# Altium schematic sheet 201_ConnectionPart2-Part1.SchDoc: Connector to Part 1
size A2; Organization: Greenfield Tech Solutions; Address1: Molendreef 33; Address2: Ossendrecht; Address3: 4641CS; Address4: The Netherlands; SheetNumber: 3; SheetTotal: 9
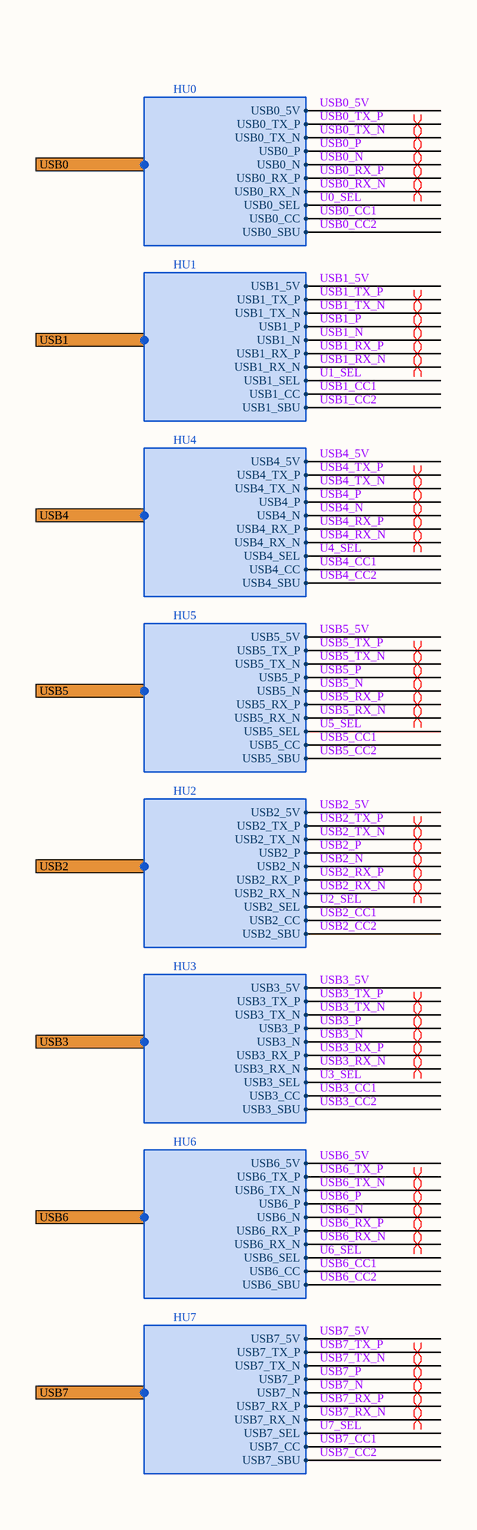
[diagram p0: 201_ConnectionPart2-Part1.SchDoc, left]
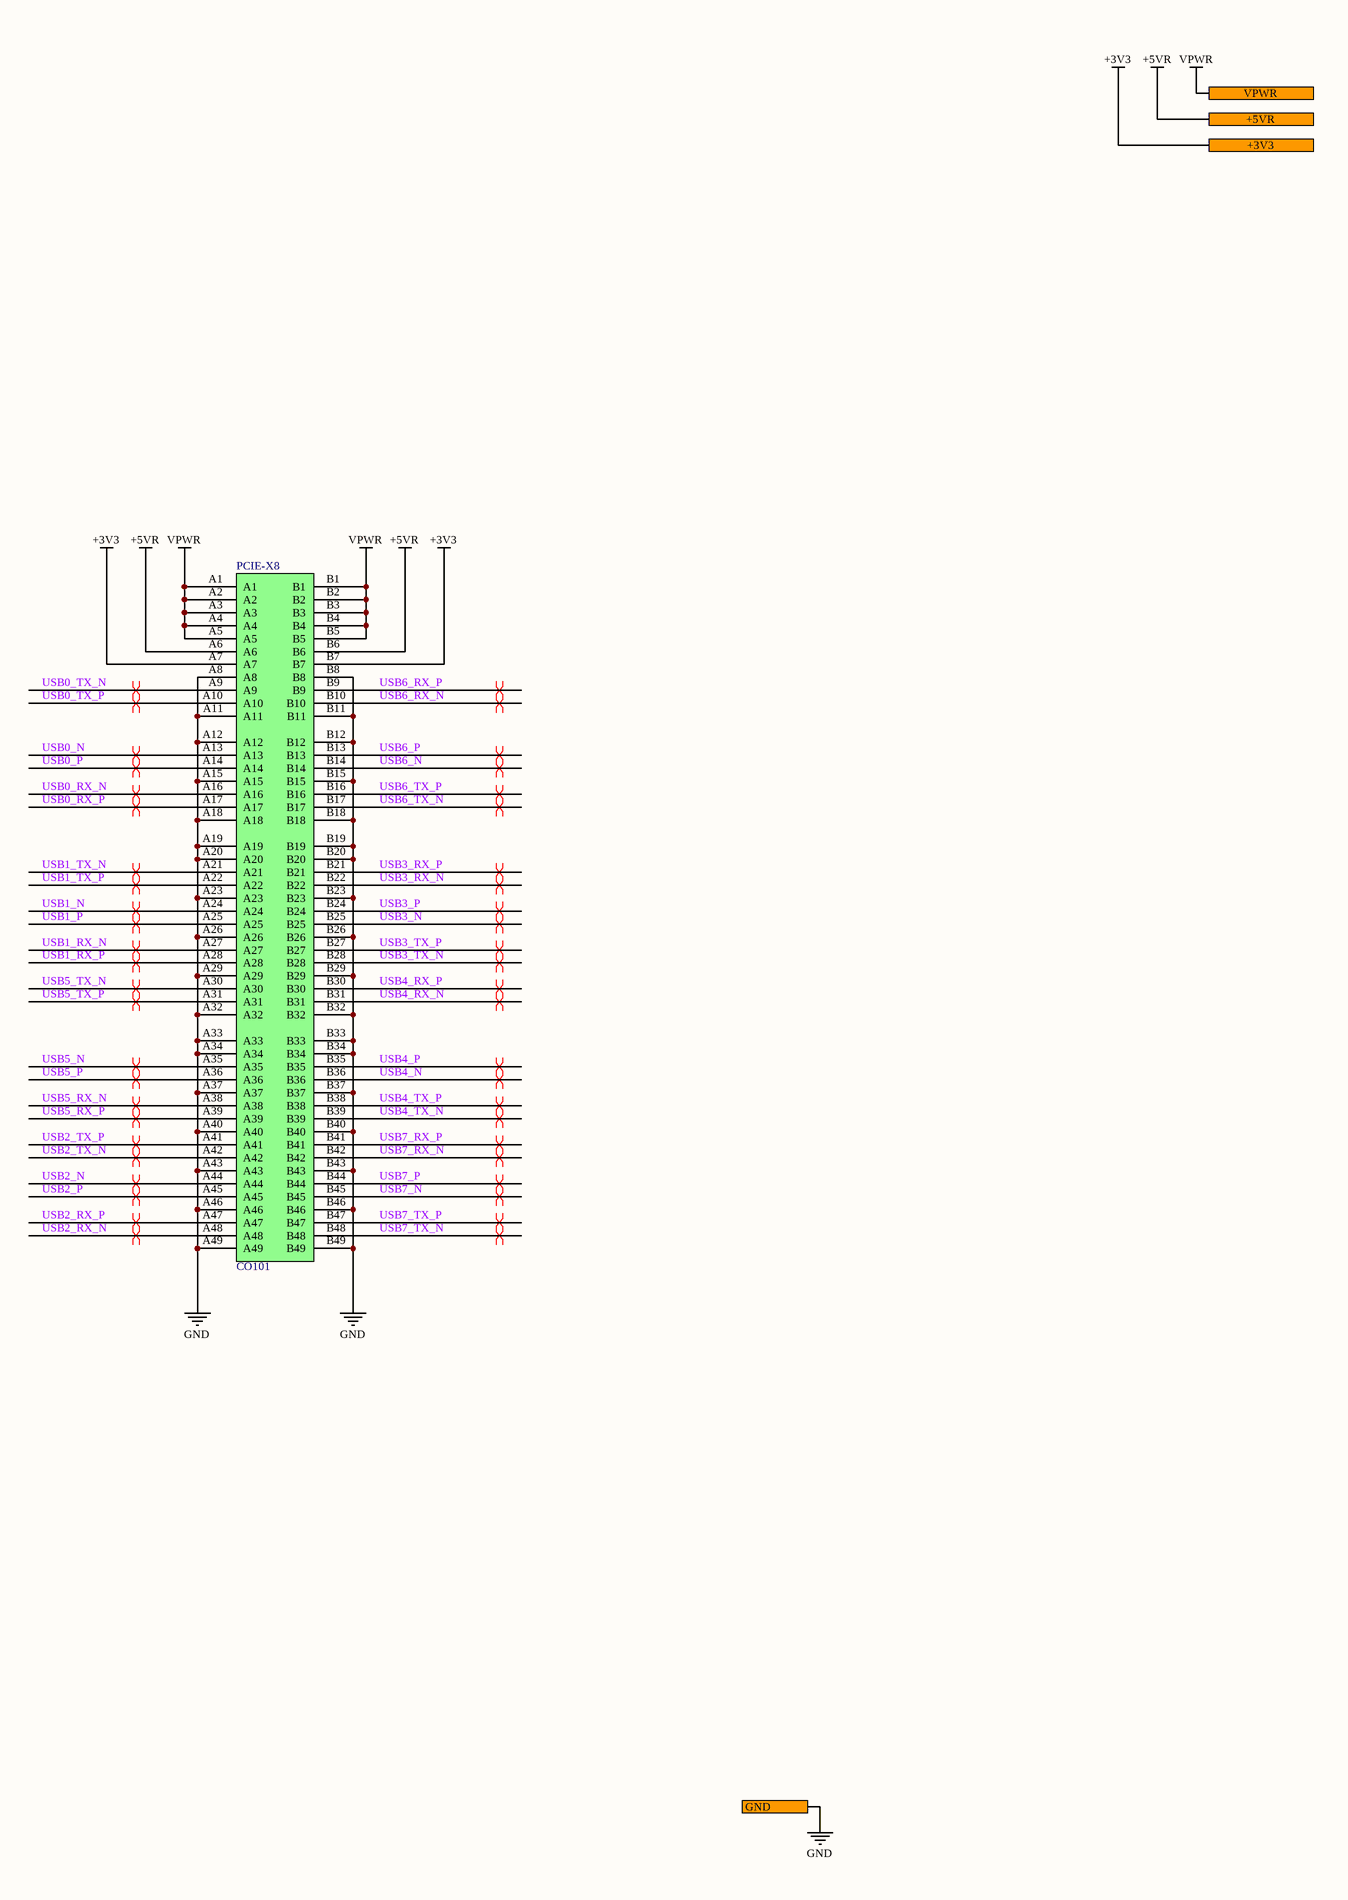
[diagram p1: 201_ConnectionPart2-Part1.SchDoc, right]

## Parts
CO101  PCIE-X8  [PCIE-X8-PCB-BASIC]

## Ports
+3V3, +5VR, GND, USB0 (harness HU0), USB1 (harness HU1), USB2 (harness HU2), USB3 (harness HU3), USB4 (harness HU4), USB5 (harness HU5), USB6 (harness HU6), USB7 (harness HU7), VPWR

## Harnesses
HU0: USB0_5V, USB0_TX_P, USB0_TX_N, USB0_N, USB0_RX_P, USB0_RX_N, USB0_SEL, USB0_P, USB0_CC, USB0_SBU
HU5: USB5_5V, USB5_TX_P, USB5_TX_N, USB5_N, USB5_RX_P, USB5_RX_N, USB5_SEL, USB5_P, USB5_CC, USB5_SBU
HU4: USB4_5V, USB4_TX_P, USB4_TX_N, USB4_N, USB4_RX_P, USB4_RX_N, USB4_SEL, USB4_P, USB4_CC, USB4_SBU
HU1: USB1_5V, USB1_TX_P, USB1_TX_N, USB1_N, USB1_RX_P, USB1_RX_N, USB1_SEL, USB1_P, USB1_CC, USB1_SBU
HU7: USB7_5V, USB7_TX_P, USB7_TX_N, USB7_N, USB7_RX_P, USB7_RX_N, USB7_SEL, USB7_P, USB7_CC, USB7_SBU
HU6: USB6_5V, USB6_TX_P, USB6_TX_N, USB6_N, USB6_RX_P, USB6_RX_N, USB6_SEL, USB6_P, USB6_CC, USB6_SBU
HU3: USB3_5V, USB3_TX_P, USB3_TX_N, USB3_N, USB3_RX_P, USB3_RX_N, USB3_SEL, USB3_P, USB3_CC, USB3_SBU
HU2: USB2_5V, USB2_TX_P, USB2_TX_N, USB2_N, USB2_RX_P, USB2_RX_N, USB2_SEL, USB2_P, USB2_CC, USB2_SBU

## Nets
+3V3: CO101.A7 CO101.B7 ; port +3V3
+5VR: CO101.A6 CO101.B6 ; port +5VR
GND: CO101.A8 CO101.A11 CO101.A12 CO101.A15 CO101.A18 CO101.A19 CO101.A20 CO101.A23 CO101.A26 CO101.A29 CO101.A32 CO101.A33 CO101.A34 CO101.A37 CO101.A40 CO101.A43 CO101.A46 CO101.A49 CO101.B8 CO101.B11 CO101.B12 CO101.B15 CO101.B18 CO101.B19 CO101.B20 CO101.B23 CO101.B26 CO101.B29 CO101.B32 CO101.B33 CO101.B34 CO101.B37 CO101.B40 CO101.B43 CO101.B46 CO101.B49 ; port GND
VPWR: CO101.A1 CO101.A2 CO101.A3 CO101.A4 CO101.A5 CO101.B1 CO101.B2 CO101.B3 CO101.B4 CO101.B5 ; port VPWR
U0_SEL: port USB0.USB0_SEL
U1_SEL: port USB1.USB1_SEL
U2_SEL: port USB2.USB2_SEL
U3_SEL: port USB3.USB3_SEL
U4_SEL: port USB4.USB4_SEL
U5_SEL: port USB5.USB5_SEL
U6_SEL: port USB6.USB6_SEL
U7_SEL: port USB7.USB7_SEL
USB0_5V: port USB0.USB0_5V
USB0_CC1: port USB0.USB0_CC
USB0_CC2: port USB0.USB0_SBU
USB0_N: CO101.A13 ; port USB0.USB0_N
USB0_P: CO101.A14 ; port USB0.USB0_P
USB0_RX_N: CO101.A16 ; port USB0.USB0_RX_N
USB0_RX_P: CO101.A17 ; port USB0.USB0_RX_P
USB0_TX_N: CO101.A9 ; port USB0.USB0_TX_N
USB0_TX_P: CO101.A10 ; port USB0.USB0_TX_P
USB1_5V: port USB1.USB1_5V
USB1_CC1: port USB1.USB1_CC
USB1_CC2: port USB1.USB1_SBU
USB1_N: CO101.A24 ; port USB1.USB1_N
USB1_P: CO101.A25 ; port USB1.USB1_P
USB1_RX_N: CO101.A27 ; port USB1.USB1_RX_N
USB1_RX_P: CO101.A28 ; port USB1.USB1_RX_P
USB1_TX_N: CO101.A21 ; port USB1.USB1_TX_N
USB1_TX_P: CO101.A22 ; port USB1.USB1_TX_P
USB2_5V: port USB2.USB2_5V
USB2_CC1: port USB2.USB2_CC
USB2_CC2: port USB2.USB2_SBU
USB2_N: CO101.A44 ; port USB2.USB2_N
USB2_P: CO101.A45 ; port USB2.USB2_P
USB2_RX_N: CO101.A48 ; port USB2.USB2_RX_N
USB2_RX_P: CO101.A47 ; port USB2.USB2_RX_P
USB2_TX_N: CO101.A42 ; port USB2.USB2_TX_N
USB2_TX_P: CO101.A41 ; port USB2.USB2_TX_P
USB3_5V: port USB3.USB3_5V
USB3_CC1: port USB3.USB3_CC
USB3_CC2: port USB3.USB3_SBU
USB3_N: CO101.B25 ; port USB3.USB3_N
USB3_P: CO101.B24 ; port USB3.USB3_P
USB3_RX_N: CO101.B22 ; port USB3.USB3_RX_N
USB3_RX_P: CO101.B21 ; port USB3.USB3_RX_P
USB3_TX_N: CO101.B28 ; port USB3.USB3_TX_N
USB3_TX_P: CO101.B27 ; port USB3.USB3_TX_P
USB4_5V: port USB4.USB4_5V
USB4_CC1: port USB4.USB4_CC
USB4_CC2: port USB4.USB4_SBU
USB4_N: CO101.B36 ; port USB4.USB4_N
USB4_P: CO101.B35 ; port USB4.USB4_P
USB4_RX_N: CO101.B31 ; port USB4.USB4_RX_N
USB4_RX_P: CO101.B30 ; port USB4.USB4_RX_P
USB4_TX_N: CO101.B39 ; port USB4.USB4_TX_N
USB4_TX_P: CO101.B38 ; port USB4.USB4_TX_P
USB5_5V: port USB5.USB5_5V
USB5_CC1: port USB5.USB5_CC
USB5_CC2: port USB5.USB5_SBU
USB5_N: CO101.A35 ; port USB5.USB5_N
USB5_P: CO101.A36 ; port USB5.USB5_P
USB5_RX_N: CO101.A38 ; port USB5.USB5_RX_N
USB5_RX_P: CO101.A39 ; port USB5.USB5_RX_P
USB5_TX_N: CO101.A30 ; port USB5.USB5_TX_N
USB5_TX_P: CO101.A31 ; port USB5.USB5_TX_P
USB6_5V: port USB6.USB6_5V
USB6_CC1: port USB6.USB6_CC
USB6_CC2: port USB6.USB6_SBU
USB6_N: CO101.B14 ; port USB6.USB6_N
USB6_P: CO101.B13 ; port USB6.USB6_P
USB6_RX_N: CO101.B10 ; port USB6.USB6_RX_N
USB6_RX_P: CO101.B9 ; port USB6.USB6_RX_P
USB6_TX_N: CO101.B17 ; port USB6.USB6_TX_N
USB6_TX_P: CO101.B16 ; port USB6.USB6_TX_P
USB7_5V: port USB7.USB7_5V
USB7_CC1: port USB7.USB7_CC
USB7_CC2: port USB7.USB7_SBU
USB7_N: CO101.B45 ; port USB7.USB7_N
USB7_P: CO101.B44 ; port USB7.USB7_P
USB7_RX_N: CO101.B42 ; port USB7.USB7_RX_N
USB7_RX_P: CO101.B41 ; port USB7.USB7_RX_P
USB7_TX_N: CO101.B48 ; port USB7.USB7_TX_N
USB7_TX_P: CO101.B47 ; port USB7.USB7_TX_P

## Layout directives
differential pair; differential pair class USB3: USB0_N, USB0_P, USB0_RX_N, USB0_RX_P, USB0_TX_N, USB0_TX_P, USB1_N, USB1_P, USB1_RX_N, USB1_RX_P, USB1_TX_N, USB1_TX_P, USB2_N, USB2_P, USB2_RX_N, USB2_RX_P, USB2_TX_N, USB2_TX_P, USB3_N, USB3_P, USB3_RX_N, USB3_RX_P, USB3_TX_N, USB3_TX_P, USB4_N, USB4_P, USB4_RX_N, USB4_RX_P, USB4_TX_N, USB4_TX_P, USB5_N, USB5_P, USB5_RX_N, USB5_RX_P, USB5_TX_N, USB5_TX_P, USB6_N, USB6_P, USB6_RX_N, USB6_RX_P, USB6_TX_N, USB6_TX_P, USB7_N, USB7_P, USB7_RX_N, USB7_RX_P, USB7_TX_N, USB7_TX_P

## Notes on the sheet
- Title
- Size:
- Date:
- File:
- A2
- Number:
- Time:
- Revision:
- Sheet
- of

## Library data of the parts
CO101 = CO0052: PCIE GEN4-X8, Male; Part Number: CO0052; ID: 52; RefVal: PCIE-X8